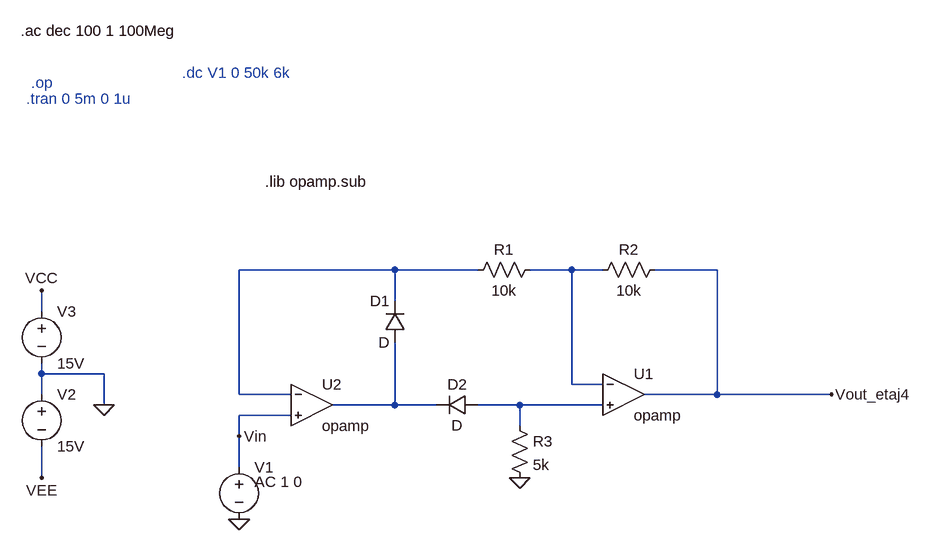
[diagram p0: schematic Redresor.asc]
Redresor.asc, the LTspice schematic file:
Version 4
SHEET 1 1428 680
WIRE 496 112 256 112
WIRE 624 112 496 112
WIRE 768 112 704 112
WIRE 816 112 768 112
WIRE 992 112 896 112
WIRE 496 160 496 112
WIRE -48 176 -48 144
WIRE -48 272 -48 256
WIRE 48 272 -48 272
WIRE 768 288 768 112
WIRE 816 288 768 288
WIRE -48 304 -48 272
WIRE 256 304 256 112
WIRE 336 304 256 304
WIRE 992 304 992 112
WIRE 992 304 880 304
WIRE 1168 304 992 304
WIRE 48 320 48 272
WIRE 496 320 496 224
WIRE 496 320 400 320
WIRE 560 320 496 320
WIRE 688 320 624 320
WIRE 816 320 688 320
WIRE 336 336 256 336
WIRE 688 352 688 320
WIRE 256 368 256 336
WIRE 256 416 256 368
WIRE -48 432 -48 384
FLAG 256 496 0
FLAG 1168 304 Vout_etaj4
FLAG 48 320 0
FLAG -48 144 VCC
FLAG -48 432 VEE
FLAG 256 368 Vin
FLAG 688 432 0
SYMBOL Res 800 128 R270
WINDOW 0 32 56 VTop 2
WINDOW 3 0 56 VBottom 2
SYMATTR InstName R2
SYMATTR Value 10k
SYMBOL Res 608 128 R270
WINDOW 0 32 56 VTop 2
WINDOW 3 0 56 VBottom 2
SYMATTR InstName R1
SYMATTR Value 10k
SYMBOL Voltage 256 400 R0
WINDOW 3 24 140 Invisible 2
WINDOW 123 24 38 Left 2
SYMATTR Value SINE(0 0.33 1k 0 0)
SYMATTR InstName V1
SYMATTR Value2 AC 1 0
SYMBOL Voltage -48 288 R0
SYMATTR InstName V2
SYMATTR Value 15V
SYMBOL Voltage -48 160 R0
SYMATTR InstName V3
SYMATTR Value 15V
SYMBOL Diode 512 224 R180
WINDOW 0 24 64 Left 2
WINDOW 3 24 0 Left 2
SYMATTR InstName D1
SYMBOL Diode 624 304 R90
WINDOW 0 0 32 VBottom 2
WINDOW 3 32 32 VTop 2
SYMATTR InstName D2
SYMBOL Res 672 336 R0
SYMATTR InstName R3
SYMATTR Value 5k
SYMBOL Opamps/opamp 848 240 R0
SYMATTR InstName U1
SYMBOL Opamps/opamp 368 256 R0
SYMATTR InstName U2
TEXT -80 -256 Left 2 !.ac dec 100 1 100Meg
TEXT -64 -176 Left 2 ;.op
TEXT -72 -152 Left 2 ;.tran 0 5m 0 1u
TEXT 168 -192 Left 2 ;.dc V1 0 50k 6k
TEXT 296 -24 Left 2 !.lib opamp.sub

The netlist it stands for:
* Redresor.asc
R2 N002 Vout_etaj4 10k
R1 N001 N002 10k
V1 Vin 0 SINE(0 0.33 1k 0 0) AC 1 0
V2 0 VEE 15V
V3 VCC 0 15V
D1 N003 N001 D
D2 N004 N003 D
R3 N004 0 5k
XU1 N002 N004 Vout_etaj4 opamp Aol=100K GBW=10Meg  ; pins invin noninvin out
XU2 N001 Vin N003 opamp Aol=100K GBW=10Meg  ; pins invin noninvin out
.model D D
.lib standard.dio
.ac dec 100 1 100Meg
* .op
* .tran 0 5m 0 1u
* .dc V1 0 50k 6k
.lib opamp.sub
.backanno
.end